# Altium schematic sheet Interconnect.SchDoc
size A4; PageSetup: Record=PageOptions|CenterHorizontal=True|CenterVertical=True|PrintScale=1.28|XCorrection=1.00|YCorrection=1.00|PrintKind=0|BorderSize=5000000|LeftOffset=0|BottomOffset=0|Orientation=2|PaperLength=1000|PaperWidth=1000|Scale=100|PaperSource=7|PrintQuality=-4|MediaType=1|DitherType=10|PaperKind=A3 297x420mm|PrintScaleMode=1; Organization: Electronic Research & Design; Address1: 11 Granofier; Address2: Zwartkop; Address3: Centurion; Address4: South Africa; Revision: 0
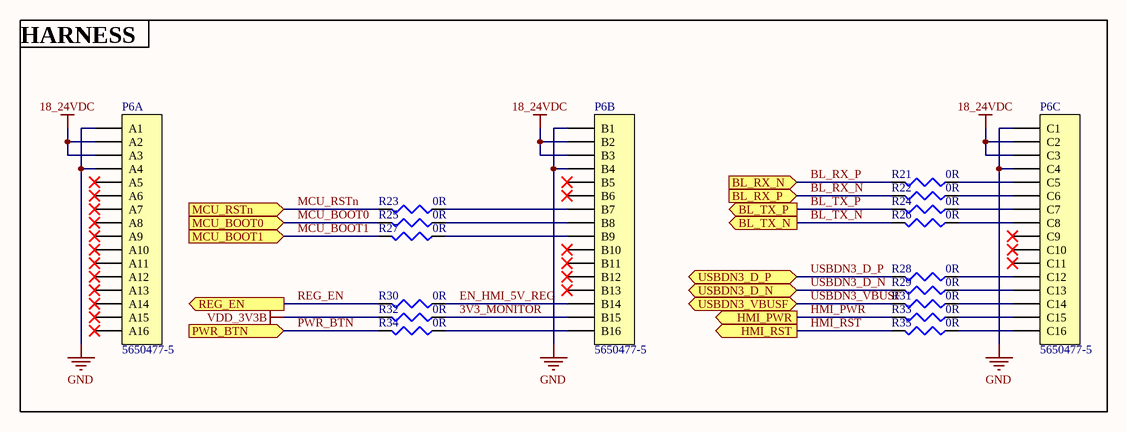
[diagram p0: Interconnect.SchDoc]

## Parts
P6  5650477-5  (parts A,B,C of 3)
R21  0R  [RC0402]
R22  0R  [RC0402]
R23  0R  [RC0402]
R24  0R  [RC0402]
R25  0R  [RC0402]
R26  0R  [RC0402]
R27  0R  [RC0402]
R28  0R  [RC0402]
R29  0R  [RC0402]
R30  0R  [RC0402]
R31  0R  [RC0402]
R32  0R  [RC0402]
R33  0R  [RC0402]
R34  0R  [RC0402]
R35  0R  [RC0402]

## Ports
BL_RX_N (in), BL_RX_P (in), BL_TX_N (out), BL_TX_P (out), HMI_PWR (out), HMI_RST (out), MCU_BOOT0 (in), MCU_BOOT1 (in), MCU_RSTn (in), PWR_BTN (in), REG_EN (out), USBDN3_D_N, USBDN3_D_P, USBDN3_VBUSF

## Nets
18_24VDC: P6.2(A2) P6.3(A3) P6.18(B2) P6.19(B3) P6.34(C2) P6.35(C3)
GND: P6.1(A1) P6.4(A4) P6.17(B1) P6.20(B4) P6.33(C1) P6.36(C4)
VDD_3V3B: R32.2
3V3_MONITOR: P6.31(B15) R32.1
BL_RX_N: R22.2 ; port BL_RX_P
BL_RX_P: R21.2 ; port BL_RX_N
BL_TX_N: R26.2 ; port BL_TX_N
BL_TX_P: R24.2 ; port BL_TX_P
EN_HMI_5V_REG: P6.30(B14) R30.1
HMI_PWR: R33.2 ; port HMI_PWR
HMI_RST: R35.2 ; port HMI_RST
MCU_BOOT0: R25.2 ; port MCU_BOOT0
MCU_BOOT1: R27.2 ; port MCU_BOOT1
MCU_RSTn: R23.2 ; port MCU_RSTn
PWR_BTN: R34.2 ; port PWR_BTN
REG_EN: R30.2 ; port REG_EN
USBDN3_D_N: R29.2 ; port USBDN3_D_N
USBDN3_D_P: R28.2 ; port USBDN3_D_P
USBDN3_VBUSF: R31.2 ; port USBDN3_VBUSF
NetP6_23: P6.23(B7) R23.1
NetP6_24: P6.24(B8) R25.1
NetP6_25: P6.25(B9) R27.1
NetP6_32: P6.32(B16) R34.1
NetP6_37: P6.37(C5) R21.1
NetP6_38: P6.38(C6) R22.1
NetP6_39: P6.39(C7) R24.1
NetP6_40: P6.40(C8) R26.1
NetP6_44: P6.44(C12) R28.1
NetP6_45: P6.45(C13) R29.1
NetP6_46: P6.46(C14) R31.1
NetP6_47: P6.47(C15) R33.1
NetP6_48: P6.48(C16) R35.1

Not connected (* = marked no-connect by the designer): P6 5(A5)* 6(A6)* 7(A7)* 8(A8)* 9(A9)* 10(A10)* 11(A11)* 12(A12)* 13(A13)* 14(A14)* 15(A15)* 16(A16)* 21(B5)* 22(B6)* 26(B10)* 27(B11)* 28(B12)* 29(B13)* 41(C9)* 42(C10)* 43(C11)*

## Notes on the sheet
- HARNESS
- Title:
- Size:
- Date:
- Project:
- A4
- Number:
- Time:
- Revision:
- Sheet
- of
- File:

## Library data of the parts
P6 = DIN_41612_3x16: DIN-41612, R/2, 48-circuit, 3x16, 2.54mm pitch, TH; Manufacturer: TE CONNECTIVITY; PartNumber: 5650477-5
R21-R35 = RES_10K_1/16W_1%_0402: RES, 0 OHM, 1/16W, 1%, 0402; Manufacturer: Yageo; PartNumber: RC0402FR-070RL; Package / Case: 0402 (1005 Metric); Supplier: AAD